# EAGLE design MRCS-Advanced-BiColor-Occupancy-Display v11 (EAGLE 7.7.0)
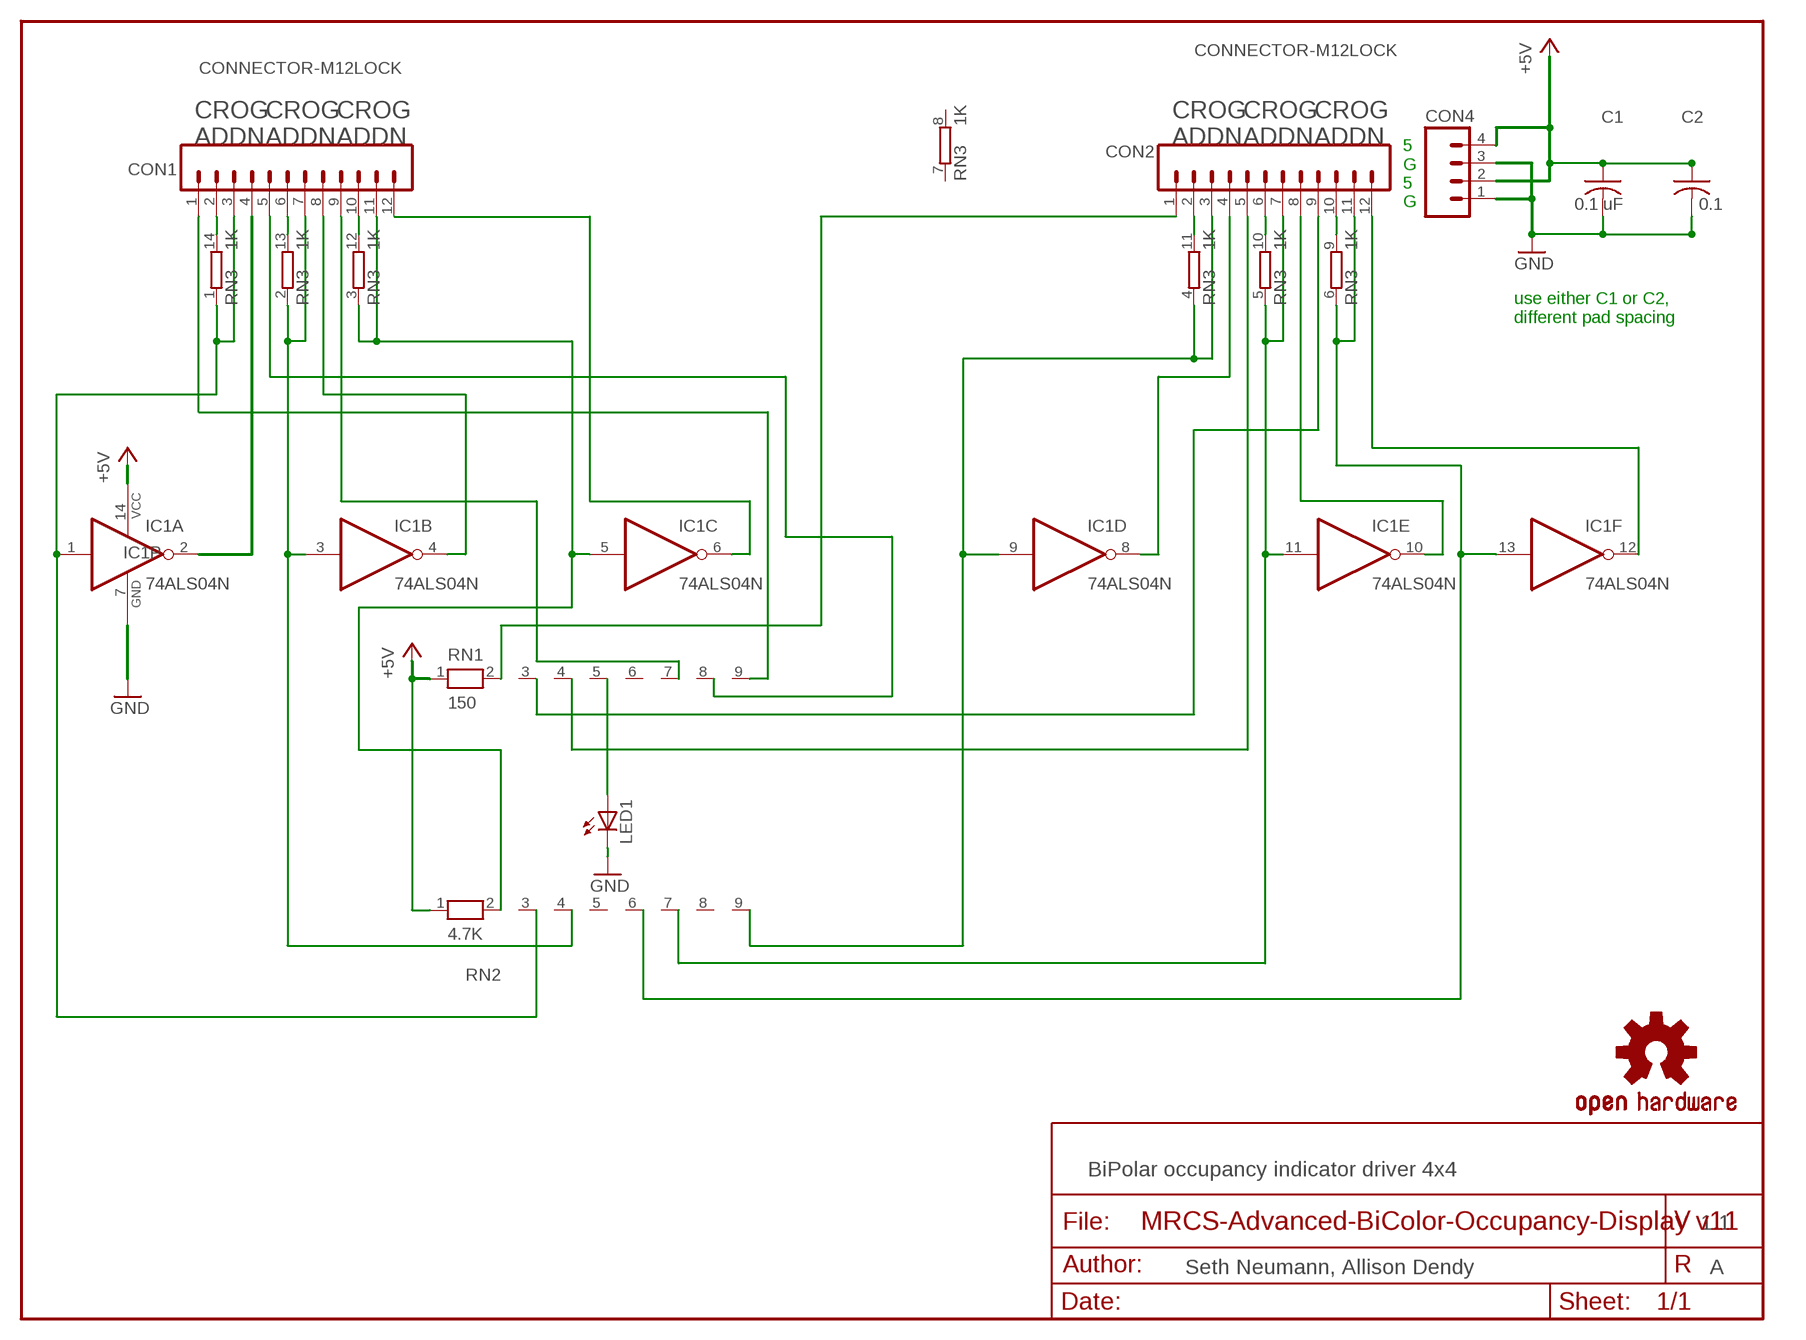
[diagram p0: schematic, sheet 1]

## Parts
C1  0.1 uF  CAPPTH2  [C-PTH-0.100]
C2  0.1  CAPPTH1  [C050-024X044]
CON1  CONNECTOR-M12LOCK  [1X12_LOCK]
CON2  CONNECTOR-M12LOCK  [1X12_LOCK]
CON4  CONNECTOR-M04SCREW  [SCREWTERMINAL-3.5MM-4]
IC1  74ALS04N  [DIL14]
LED1  LEDLED3MM  [LED3MM]
OSHW1  DOC-OSHW-LOGO-M  [OSHW-LOGO-M]
RN1  150  RN08  [RN-9]
RN2  4.7K  RN08  [RN-9]
RN3  1K  7R-P  [DIL14]

## Nets
GND: C1.2 C2.2 CON4.1 CON4.3 IC1.7(P:GND) LED1.K(C)
N$1: CON1.2 RN3.14
N$2: CON1.11 IC1.5(C:I) RN2.2 RN3.3
N$3: CON1.1 RN1.9
N$4: CON1.4 IC1.2(A:O)
N$5: CON1.7 IC1.3(B:I) RN2.4 RN3.2
N$6: CON1.12 IC1.6(C:O)
N$7: CON1.8 IC1.4(B:O)
N$8: CON1.5 RN1.8
N$9: CON2.3 IC1.9(D:I) RN2.9 RN3.4
N$10: CON1.9 RN1.7
N$11: CON2.8 IC1.10(E:O)
N$12: CON2.12 IC1.12(F:O)
N$13: CON2.4 IC1.8(D:O)
N$14: CON2.1 RN1.2
N$15: CON2.5 RN1.4
N$16: CON1.3 IC1.1(A:I) RN2.3 RN3.1
N$17: LED1.A RN1.5
N$18: CON2.7 IC1.11(E:I) RN2.7 RN3.5
N$19: CON2.9 RN1.3
N$20: CON2.11 IC1.13(F:I) RN2.6 RN3.6
N$21: CON1.6 RN3.13
N$22: CON1.10 RN3.12
N$23: CON2.2 RN3.11
N$24: CON2.6 RN3.10
N$25: CON2.10 RN3.9
VCC: C1.1 C2.1 CON4.2 CON4.4 IC1.14(P:VCC) RN1.1 RN2.1 ; supply symbol labelled +5V
Unconnected: RN1.6 RN2.5 RN2.8 RN3.7 RN3.8

## Notes on the sheet
- CROG
  ADDN
- CROG
  ADDN
- CROG
  ADDN
- CROG
  ADDN
- CROG
  ADDN
- CROG
  ADDN
- 5
  G
  5
  G
- use either C1 or C2, 
  different pad spacing
- BiPolar occupancy indicator driver 4x4
- 1.1
- Seth Neumann, Allison Dendy | A

## Library data of the parts
C1 C2 = SPCoast:CAP*
CON1 CON2 = SPCoast:CONNECTOR-M12: Header 12 Standard 12-pin 0.1" header. Use with straight break away headers (SKU : PRT-00116), right angle break away headers (PRT-00553), swiss pins (PRT-00743), machine pins (PRT-00117), and female headers (PRT-00115).
CON4 = SPCoast:CONNECTOR-M04: Header 4 Standard 4-pin 0.1" header. Use with straight break away headers (SKU : PRT-00116), right angle break away headers (PRT-00553), swiss pins (PRT-00743), machine pins (PRT-00117), and female headers (PRT-00115). Molex polarized connector foot print use with SKU : PRT-08231 with associated crimp pins and housings. 1MM SMD Version SKU: PRT-10208
IC1 = 74xx-us:74*04: Hex INVERTER
LED1 = SPCoast:LED*
OSHW1 = SPCoast:DOC-OSHW-LOGO-: Open Source Hardware Logo This logo indicates the piece of hardware it is found on incorporates a OSHW license and/or adheres to the definition of open source hardware http://freedomdefined.org/OSHW Creative Commons - Attribution - ShareAlike 3.0
RN1 RN2 = resistor-net:RN08: RESISTOR NETWORK; OC_FARNELL: unknown; OC_NEWARK: unknown
RN3 = resistor-dil:7R-P: DIL RESISTOR; OC_FARNELL: unknown; OC_NEWARK: unknown

## Board
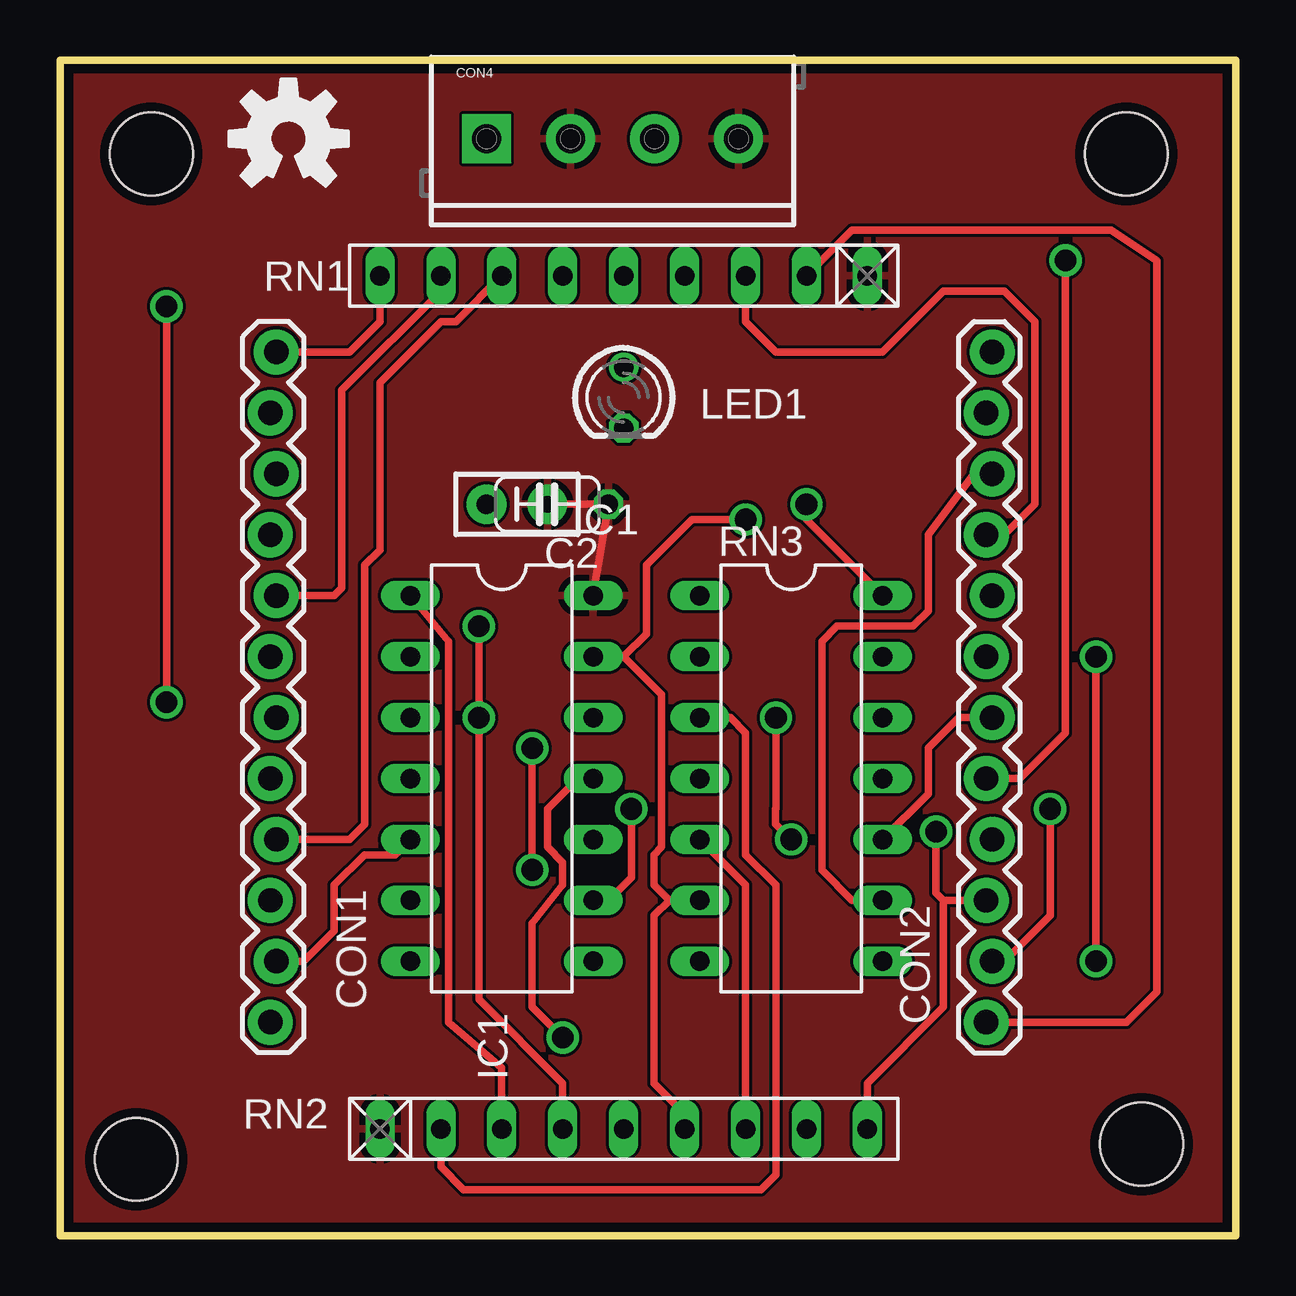
[diagram p1: board, top side]
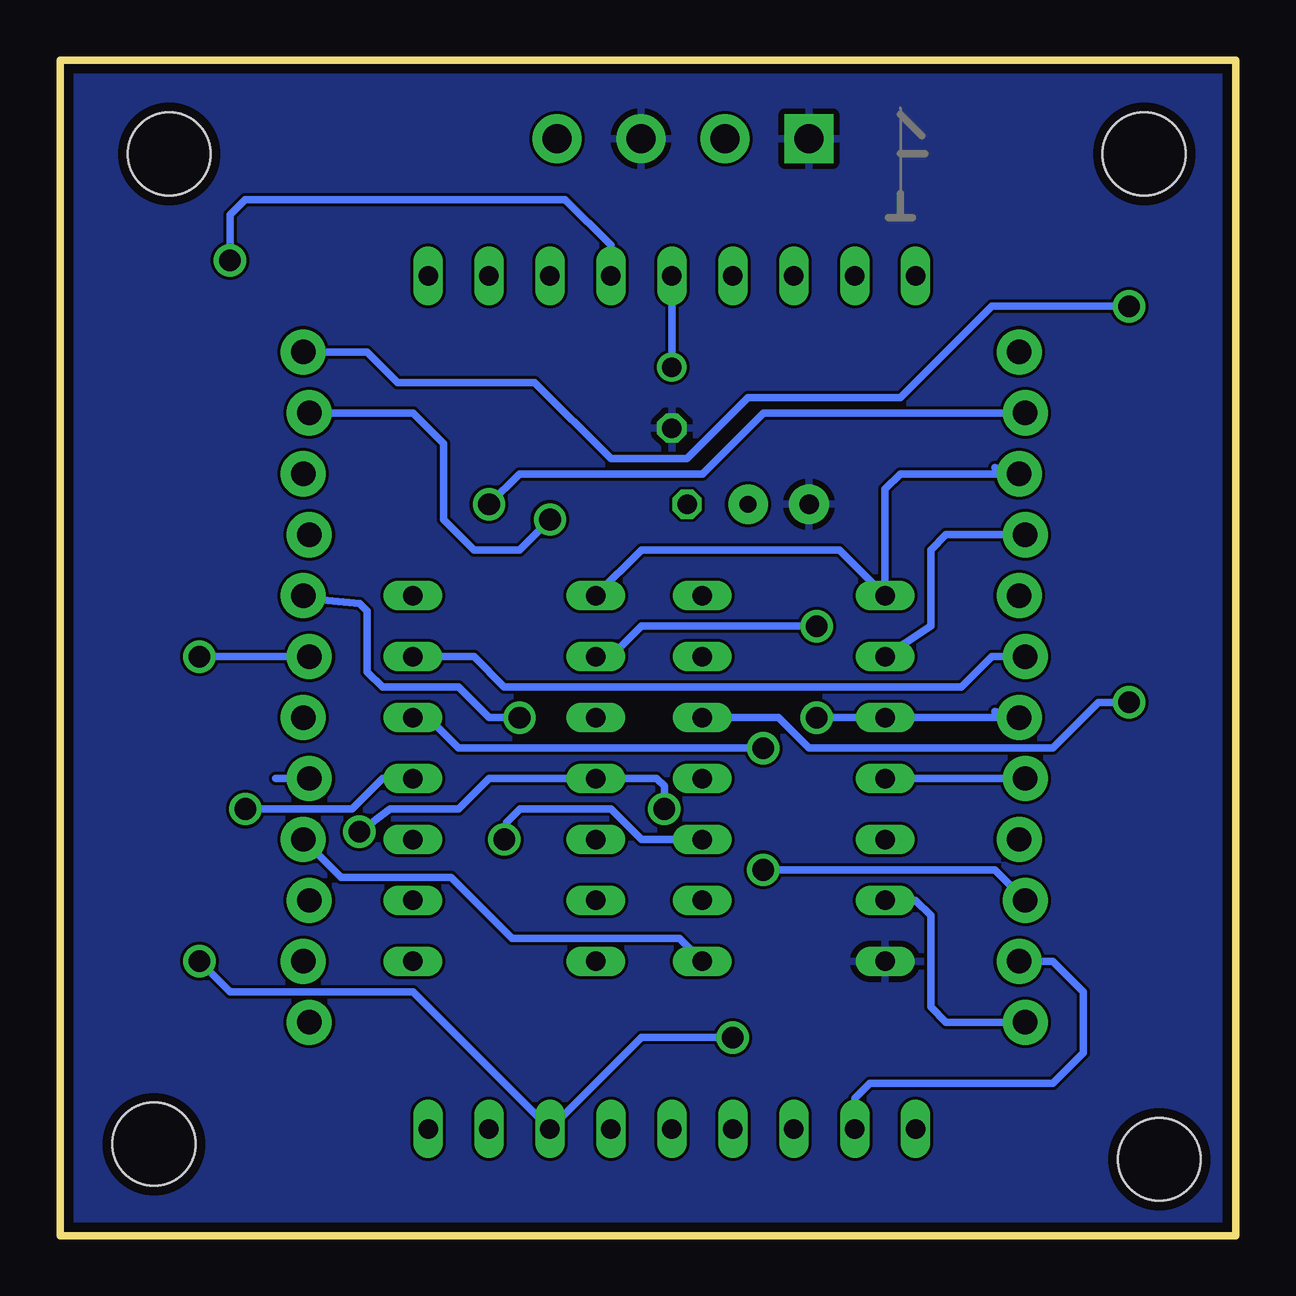
[diagram p2: board, bottom side, seen from below]

Size 49 x 49 mm. Coordinates in mm from the lower left corner, seen from the top.
Outline: 0,0 49,0 49,49 0,49 0,0
Copper layers (1*16): Top 0.035mm / dielectric 1.5mm / Bottom 0.035mm
Design rules "default *": minimum track width 5mil, minimum drill 0.2mm, track to track 5mil, track to pad 5mil, pad to pad 5mil, via to via 5mil, smd to smd 5mil, copper to edge 0.4mm, drill to drill 5mil, minimum pad ring 3mil, minimum via ring 3mil, stop-mask expansion 4mil, vias tented up to drill 0mil, thermal gap 10mil
Holes 3.45 mm at 3.81,45.09 44.45,45.09 45.09,3.81 3.17,3.17

### Footprints (pad centres in the part's own frame; a part is rotated, then mirrored left to right if it is on the bottom)
C-PTH-0.100 = drill 0.7 pad 1.651: 1 -1.27,0; 2 1.27,0
C050-024X044 = drill 0.813 octagon: 1 -2.54,0; 2 2.54,0
1X12_LOCK = drill 1.016 pad 1.88: 1 0,0.127; 2 2.54,-0.127; 3 5.08,0.127; 4 7.62,-0.127; 5 10.16,0.127; 6 12.7,-0.127; 7 15.24,0.127; 8 17.78,-0.127; 9 20.32,0.127; 10 22.86,-0.127; 11 25.4,0.127; 12 27.94,-0.127
SCREWTERMINAL-3.5MM-4 = drill 1.2 pad 2.032 square: 1 0,0 | drill 1.2 pad 2.032: 2 3.5,0; 3 7,0; 4 10.5,0
DIL14 = drill 0.813 long: 1 -7.62,-3.81; 2 -5.08,-3.81; 3 -2.54,-3.81; 4 0,-3.81; 5 2.54,-3.81; 6 5.08,-3.81; 7 7.62,-3.81; 8 7.62,3.81; 9 5.08,3.81; 10 2.54,3.81; 11 0,3.81; 12 -2.54,3.81; 13 -5.08,3.81; 14 -7.62,3.81
LED3MM = drill 0.813: A 1.27,0 | drill 0.813 octagon: K -1.27,0
RN-9 = drill 0.813 long: 1 -10.16,0; 2 -7.62,0; 3 -5.08,0; 4 -2.54,0; 5 0,0; 6 2.54,0; 7 5.08,0; 8 7.62,0; 9 10.16,0

### Placement (x,y rotation side)
C1  19.05,30.48 180 top
C2  20.32,30.48 180 top
CON1  8.89,36.83 270 top
CON2  38.73,8.89 90 top
CON4  17.78,45.72 0 top
IC1  18.41,19.05 270 top
LED1  23.5,34.92 90 top
OSHW1  9.53,45.72 0 top
RN1  23.5,40.01 180 top
RN2  23.5,4.45 0 top
RN3  30.48,19.05 270 top
U$1  [CA-PROP65WARNING]  45.09,25.4 90 top
U$2  [MRCSLOGOBTM]  7.62,41.91 0 top

### Tracks (layer width: path | path; a pad name or v marks a point on that pad's centre or on a via)
GND
  pour Bottom: 0,0 49,0 48.9,48.9 0,48.9
N$1  (via drill 0.9)
  Top 0.305: v31.11,30.48 31.11,29.84 RN3.14
  Bottom 0.305: CON1.2 19.68,34.29 22.23,31.75 29.84,31.75 v31.11,30.48
N$2
  Top 0.305: CON1.11 10.16,11.43 11.43,12.7 11.43,14.61 12.7,15.88 13.97,15.88 IC1.5 | RN3.3 27.94,21.59 28.57,20.95 28.57,15.88 29.84,14.61 29.84,2.54 29.21,1.91 16.83,1.91 15.88,2.86 RN2.2
  Bottom 0.305: CON1.11 7.62,11.43 6.35,10.16 6.35,7.62 7.62,6.35 15.24,6.35 15.88,5.71 RN2.2
N$3
  Top 0.305: CON1.1 12.06,36.83 13.34,38.1 RN1.9
N$4
  Bottom 0.305: CON1.4 12.06,29.21 12.7,28.57 12.7,25.4 IC1.2
N$5  (via drill 0.9)
  Top 0.305: RN2.4 20.95,6.35 17.46,9.84 v17.46,21.59 v17.46,25.4
  Bottom 0.305: 10.03,21.84 CON1.7 IC1.3 v17.46,21.59 | RN3.2 26.04,24.13 24.77,25.4 v17.46,25.4
N$6
  Bottom 0.305: CON1.12 12.06,8.89 12.7,9.53 12.7,13.34 13.34,13.97 IC1.6
N$7
  Bottom 0.305: CON1.8 IC1.4
N$8
  Top 0.305: CON1.5 11.43,26.67 11.75,26.99 11.75,35.24 15.88,39.37 RN1.8
N$9  (via drill 0.9)
  Top 0.305: RN2.9 33.66,6.35 36.83,9.53 36.83,13.97 | v36.51,16.83 36.51,14.29 36.83,13.97 | 36.83,13.97 CON2.3 | IC1.9 22.86,13.97 23.81,14.92 v23.81,17.78
  Bottom 0.305: v36.51,16.83 35.24,17.78 32.38,17.78 31.11,19.05 RN3.4 24.13,19.05 23.81,18.73 v23.81,17.78
N$10
  Top 0.305: RN1.7 16.51,38.1 15.88,38.1 13.34,35.56 13.34,28.57 12.7,27.94 12.7,17.14 12.06,16.51 CON1.9
N$11  (via drill 0.9)
  Top 0.305: v29.84,21.59 29.84,17.8 29.82,17.78 29.82,17.16 v30.48,16.51
  Bottom 0.305: IC1.10 24.77,16.51 26.04,17.78 29.82,17.78 30.39,17.21 30.39,16.6 v30.48,16.51 | v29.84,21.59 31.11,21.59 32.38,22.86 35.56,22.86 36.2,23.5 36.2,26.04 36.51,26.35 38.73,26.54 CON2.8
N$12  (via drill 0.9)
  Top 0.305: v4.45,38.73 v4.45,22.23
  Bottom 0.305: CON2.12 36.2,36.83 34.92,35.56 29.21,35.56 26.04,32.38 22.86,32.38 20.32,34.92 13.97,34.92 10.16,38.73 v4.45,38.73 | v4.45,22.23 5.71,22.23 7.62,20.32 17.78,20.32 19.05,21.59 IC1.12
N$13
  Bottom 0.305: IC1.8 23.18,12.38 30.16,12.38 32.7,14.92 37.27,14.92 CON2.4
N$14
  Top 0.305: CON2.1 44.45,8.89 45.72,10.16 45.72,40.64 43.81,41.91 33.02,41.91 RN1.2
N$15  (via drill 0.9)
  Top 0.305: v41.91,40.64 41.91,20.95 40.01,19.05 CON2.5
  Bottom 0.305: RN1.4 26.04,41.27 27.94,43.18 41.27,43.18 41.91,42.55 v41.91,40.64 | 40.01,19.05 CON2.5
N$16
  Top 0.305: RN2.3 18.41,6.99 16.19,8.89 16.19,24.77 IC1.1
  Bottom 0.305: 10.03,32 CON1.3 13.97,31.75 14.61,31.11 IC1.1 16.51,28.57 24.77,28.57 RN3.1
N$17
  Bottom 0.305: RN1.5 LED1.A
N$18  (via drill 0.9)
  Top 0.305: RN2.7 28.57,14.61 RN3.5 27.3,16.51 | v43.18,24.13 v43.18,11.43 | IC1.11 21.59,19.05 20.32,17.78 20.32,16.19 20.95,15.56 20.95,14.61 19.68,13.02 19.68,9.53 v20.95,8.26
  Bottom 0.305: CON2.7 v43.18,24.13 | v43.18,11.43 41.91,10.16 34.29,10.16 RN2.7 24.77,8.26 v20.95,8.26
N$19
  Top 0.305: CON2.9 39.37,29.21 40.64,30.48 40.64,38.1 39.37,39.37 36.83,39.37 34.29,36.83 29.84,36.83 28.57,38.1 RN1.3
N$20  (via drill 0.9)
  Top 0.305: RN2.6 26.04,5.08 24.77,6.35 24.77,13.34 25.4,13.97 | 25.4,13.97 RN3.6 | v28.57,29.84 26.35,29.84 24.45,27.94 24.45,25.08 23.5,24.13 | 23.5,24.13 IC1.13 | 25.4,13.97 24.77,14.61 24.77,15.88 25.08,16.19 25.08,22.54 23.5,24.13
  Bottom 0.305: CON2.11 34.29,34.29 33.02,33.02 33.02,29.84 31.75,28.57 29.84,28.57 v28.57,29.84
N$21
  Bottom 0.305: CON1.6 10.16,24.13 11.43,22.86 30.48,22.86 31.75,24.13 RN3.13
N$22  (via drill 0.9)
  Top 0.305: v19.68,20.32 v19.68,15.24
  Bottom 0.305: RN3.12 33.66,21.59 32.38,20.32 v19.68,20.32 | v19.68,15.24 10.03,15.24 CON1.10
N$23  (via drill 0.9)
  Top 0.305: v41.27,17.78 41.27,13.34 39.37,11.43 CON2.2
  Bottom 0.305: RN3.11 35.56,19.05 36.83,17.78 v41.27,17.78
N$24
  Top 0.305: RN3.10 36.2,18.41 36.2,20.32 37.47,21.59 CON2.6
N$25
  Top 0.305: RN3.9 33.02,13.97 31.75,15.24 31.75,24.77 32.38,25.4 35.56,25.4 36.2,26.04 36.2,29.21 38.1,31.75 CON2.10
VCC
  Top 0.305: C1.1 C2.1 IC1.14
  pour Top: 0,0 49,0 49,48.9 0,48.9

### Text on the board
tDocu: G 5 G 5 | CROG / ADDN | CROG / ADDN | CROG / ADDN | CROG / ADDN | CROG / ADDN | CROG / ADDN
bDocu: BiPolar LED Occupancy | V 1.1 / 20231026 | Seth Neumann / Allison Dendy